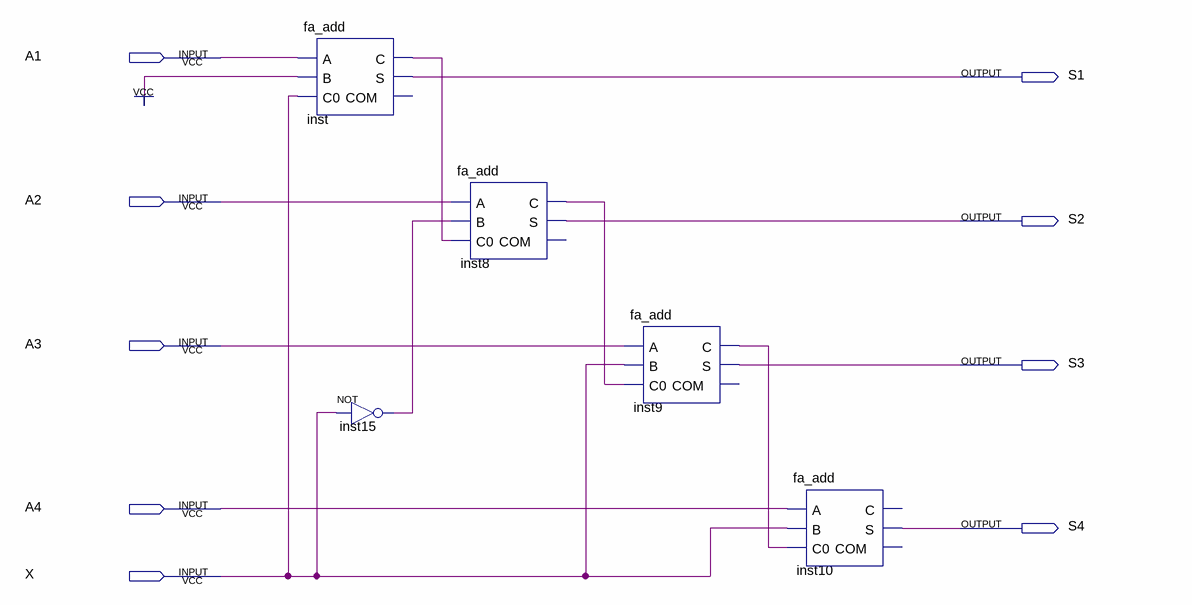
[diagram p0: schematic sheet]
// Quartus schematic exhange.bdf as structural Verilog: 5 symbols, 9 pins
module exhange (
  input  A1,
  input  A2,
  input  A3,
  input  A4,
  input  X,
  output S1,
  output S2,
  output S3,
  output S4
);

  wire inst8_c, inst9_c, inst15_out, inst_c;

  fa_add inst (.A(A1), .B(1'b1), .C0(X), .C(inst_c), .S(S1));  // open: COM
  not inst15 (inst15_out, X);
  fa_add inst8 (.A(A2), .B(inst15_out), .C0(inst_c), .C(inst8_c), .S(S2));  // open: COM
  fa_add inst9 (.A(A3), .B(X), .C0(inst8_c), .C(inst9_c), .S(S3));  // open: COM
  fa_add inst10 (.A(A4), .B(X), .C0(inst9_c), .S(S4));  // open: C, COM
endmodule
